# EAGLE design IrrigationControl (EAGLE 7.0.0)
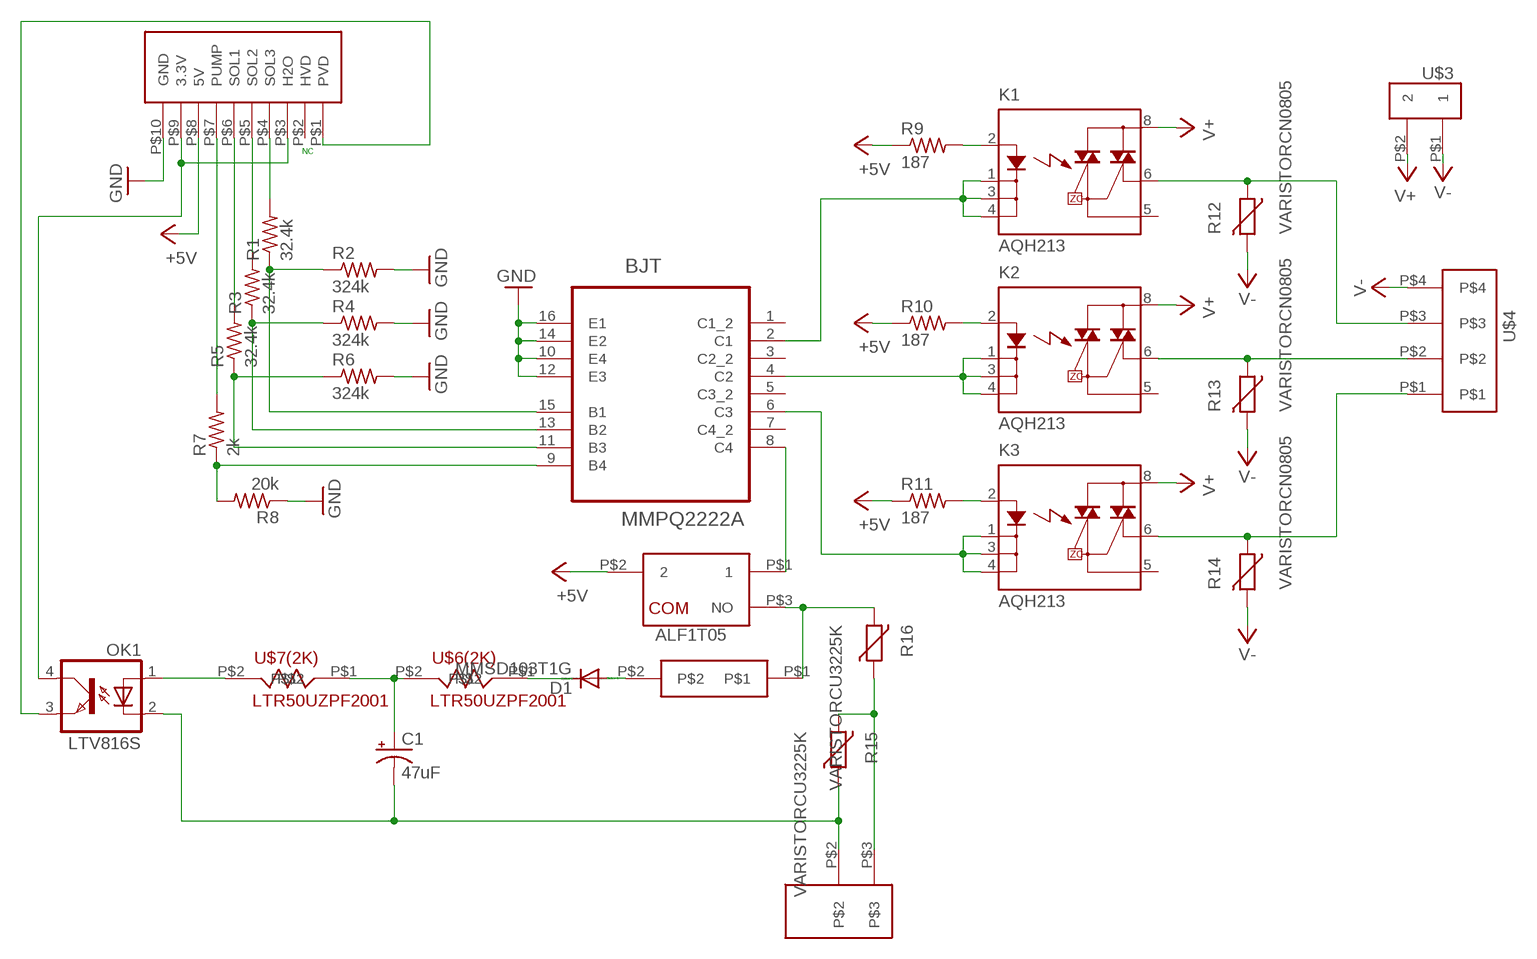
[diagram p0: schematic, sheet 1]

## Parts
ALF1T05  ALF1T05  [TMP]
BJT  MMPQ2222A  [SOIC127P600X175-16N]
C1  47uF  CPOL-USE5-10.5  [E5-10,5]
D1  MMSD103T1G  DIODE-SOD123  [SOD123]
K1  AQH213  [DIL07]
K2  AQH213  [DIL07]
K3  AQH213  [DIL07]
OK1  LTV816S  [SMD4]
R1  32.4k  R-US_R0805  [R0805]
R2  324k  R-US_R0805  [R0805]
R3  32.4k  R-US_R0805  [R0805]
R4  324k  R-US_R0805  [R0805]
R5  32.4k  R-US_R0805  [R0805]
R6  324k  R-US_R0805  [R0805]
R7  2k  R-US_R0805  [R0805]
R8  20k  R-US_R0805  [R0805]
R9  187  R-US_R0805  [R0805]
R10  187  R-US_R0805  [R0805]
R11  187  R-US_R0805  [R0805]
R12  VARISTORCN0805  [CT/CN0805]
R13  VARISTORCN0805  [CT/CN0805]
R14  VARISTORCN0805  [CT/CN0805]
R15  VARISTORCU3225K  [CU3225K]
R16  VARISTORCU3225K  [CU3225K]
U$1  OSTT7030150  [OSTT7030150]
U$2  OSTTE100104  [OSTTE100104]
U$3  OSTTC020162  [OSTTC020162]
U$4  OSTTE040104  [OSTTEX040104]
U$5  SST-357  [SST]
U$6(2K)  LTR50UZPF2001  [WIDE2010]
U$7(2K)  LTR50UZPF2001  [WIDE2010]

## Nets
+5V: ALF1T05.P$2 R9.1 R10.1 R11.1 U$2.P$8(5V)
GND: BJT.10(E4) BJT.12(E3) BJT.14(E2) BJT.16(E1) R2.2 R4.2 R6.2 R8.1 U$2.P$10(GND)
N$1: BJT.13(B2) R3.1 R4.1
N$2: R7.2 U$2.P$7(PUMP)
N$3: BJT.15(B1) R1.1 R2.1
N$4: R5.2 U$2.P$6(SOL1)
N$5: R3.2 U$2.P$5(SOL2)
N$6: BJT.11(B3) R5.1 R6.1
N$7: BJT.9(B4) R7.1 R8.2
N$8: OK1.4(COL) U$2.P$3(H2O) U$2.P$9(3.3V)
N$9: ALF1T05.P$1 BJT.8(C4)
N$10 [120VAC]: ALF1T05.P$3(NO) R16.2 U$5.P$1
N$11: K3.2(A) R11.2
N$12: K2.2(A) R10.2
N$13: K1.2(A) R9.2
N$14: BJT.6(C3) K3.1(K) K3.3(K1) K3.4(K2)
N$15: BJT.4(C2) K2.1(K) K2.3(K1) K2.4(K2)
N$16: BJT.2(C1) K1.1(K) K1.3(K1) K1.4(K2)
N$18: K1.6(DS3) R12.1 U$4.P$3
N$19: K2.6(DS3) R13.1 U$4.P$2
N$20: K3.6(DS3) R14.1 U$4.P$1
N$21 [120VAC]: D1.A U$5.P$2
N$22 [120VAC]: R15.2 R16.1 U$1.P$3
N$23 [120VAC]: C1.- OK1.2(C) R15.1 U$1.P$2
N$24 [170VDC]: D1.C U$6(2K).P$1
N$25 [85VDC]: C1.+ U$6(2K).P$2 U$7(2K).P$1
N$26: OK1.1(A) U$7(2K).P$2
N$27: OK1.3(EMIT) U$2.P$1(PVD)
N$29: R1.2 U$2.P$4(SOL3)
V+: K1.8(DS1) K2.8(DS1) K3.8(DS1) U$3.P$2
V-: R12.2 R13.2 R14.2 U$3.P$1 U$4.P$4
Unconnected: BJT.1(C1_2) BJT.3(C2_2) BJT.5(C3_2) BJT.7(C4_2) K1.5(DS2) K2.5(DS2) K3.5(DS2) U$2.P$2(HVD)

## Notes on the sheet
- NC

## Library data of the parts
ALF1T05 = TJ:ALF1T05: 20 Amp Power Relay from Panasonic
BJT = Fairchild_By_element14_Batch_1:MMPQ2222A: NPN Multi-Chip General Purpose Amplifier; MPN: MMPQ2222A; OC_FARNELL: 2101390; OC_NEWARK: 10P1562; PACKAGE: SOIC-16; SUPPLIER: FAIRCHILD SEMICONDUCTOR
C1 = rcl:CPOL-US: POLARIZED CAPACITOR, American symbol
D1 = diode:DIODE-: DIODE
K1-K3 = relay:AQH*213: SOLID STATE RELAY NAiS Source: http://www.mew-europe.com/.. en_ds_61613_0000.pdf; OC_FARNELL: unknown; OC_NEWARK: unknown
OK1 = optocoupler:LTV816: OPTO COUPLER Source: LITEON, LTV816.pdf; OC_FARNELL: unknown; OC_NEWARK: unknown
R1-R11 = resistor:R-US_: RESISTOR, American symbol
R12-R16 = varistor:VARISTOR: VARISTOR
U$1 = TJ:OSTT7030150
U$2 = TJ:OSTTE100104
U$3 = TJ:OSTTC020162
U$4 = TJ:OSTTE040104
U$5 = TJ:SST-357: 375mA, 125VAC tolerant slow blow surface mount fuse from Bel Fuse Inc.
U$6(2K) U$7(2K) = TJ:LTR50UZPF2001

## Net classes
1 120VAC: width 1.778 mm, drill 2.159 mm, clearance 2.159 mm
2 170VDC: width 1.27 mm, drill 2.159 mm, clearance 2.159 mm
3 85VDC: drill 1.092 mm, clearance 1.092 mm

## Board
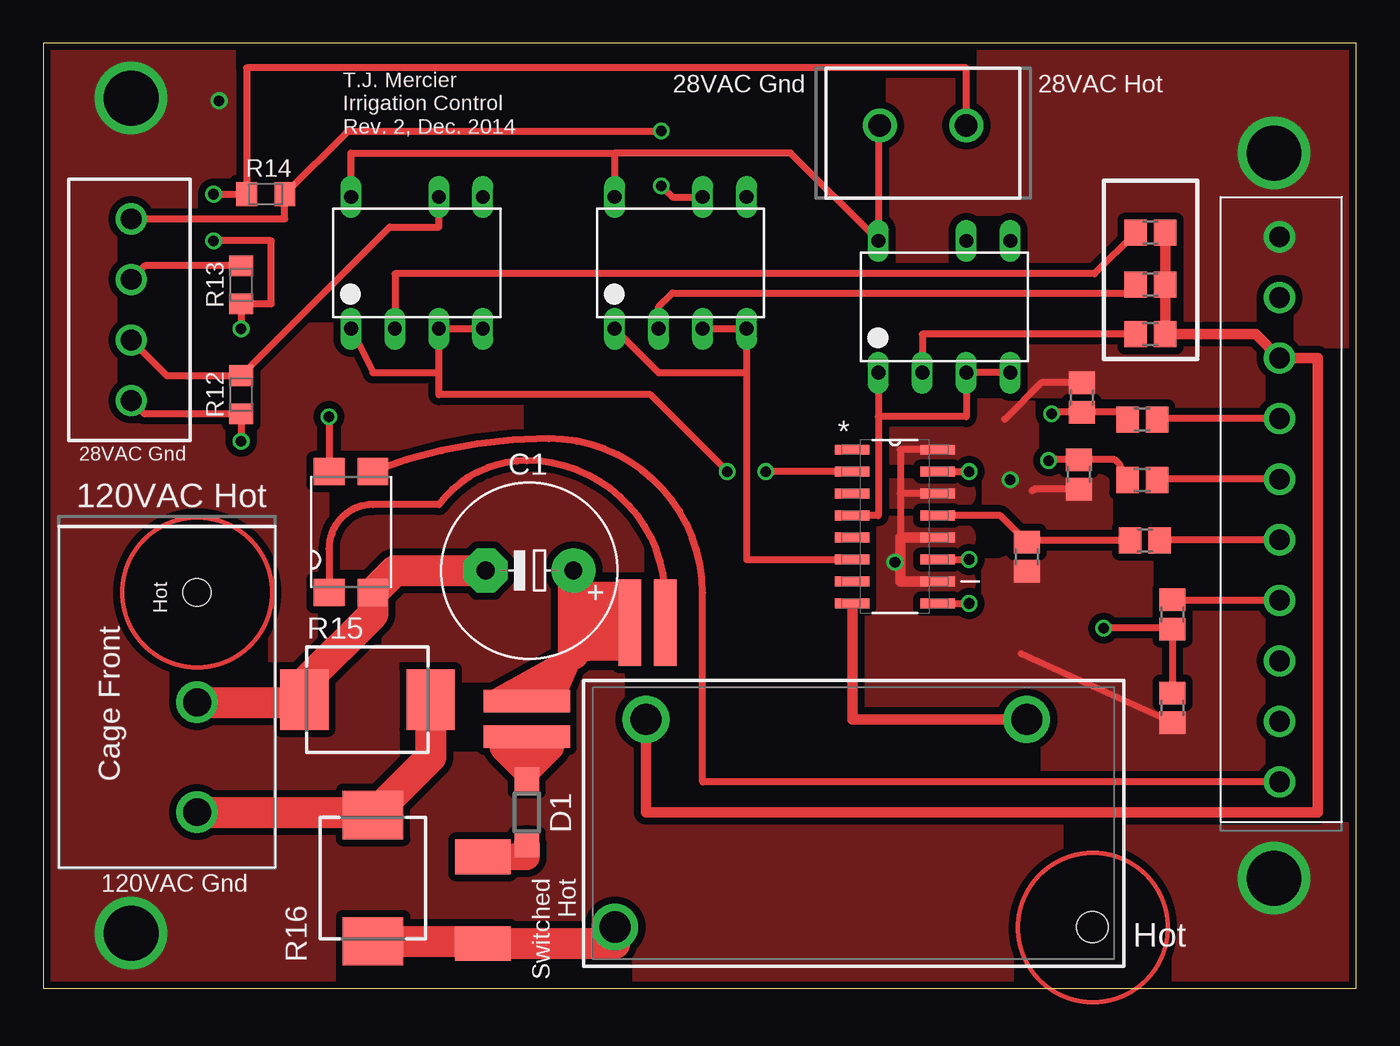
[diagram p1: board, top side]
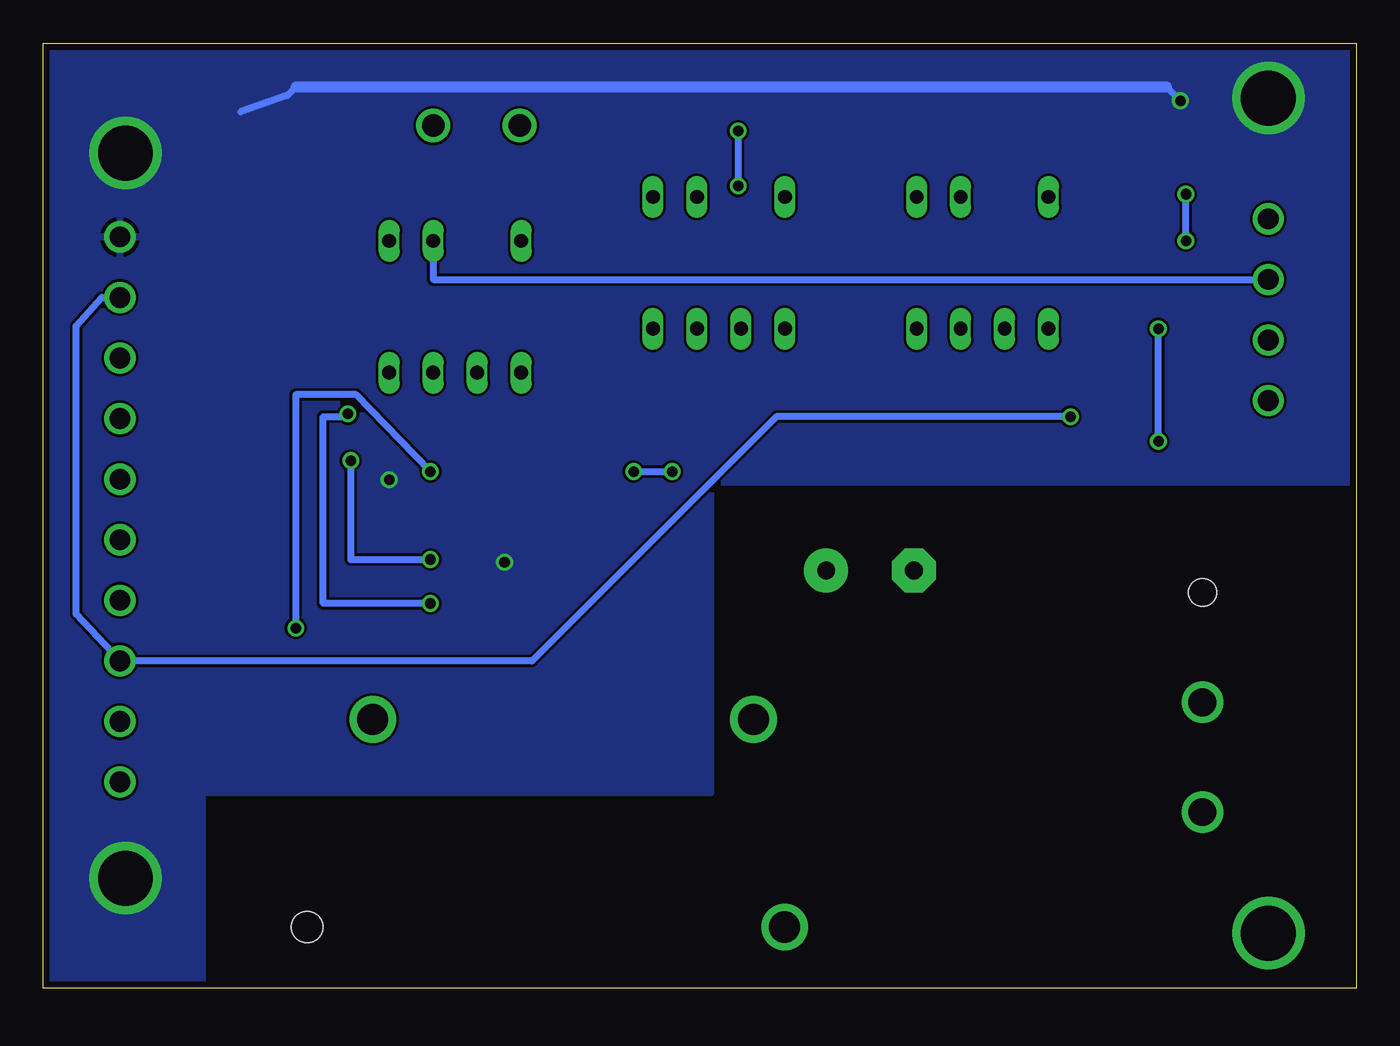
[diagram p2: board, bottom side, seen from below]

Size 75.87 x 54.6 mm. Coordinates in mm from the lower left corner, seen from the top.
Outline: 0,0 75.87,0 75.87,54.6 0,54.6 0,0
Copper layers (1*16): Top 0.0356mm / dielectric 1.5011mm / Bottom 0.0356mm
Design rules "LaenPCBOrder": minimum track width 6mil, minimum drill 13mil, track to track 6mil, track to pad 6mil, pad to pad 6mil, via to via 6mil, smd to smd 6mil, copper to edge 15mil, drill to drill 6mil, minimum pad ring 7mil, minimum via ring 7mil, stop-mask expansion 3mil, vias tented up to drill 0mil, thermal gap 10mil

### Footprints (pad centres in the part's own frame; a part is rotated, then mirrored left to right if it is on the bottom)
TMP = drill 1.8: P$1 -10,-6; P$2 12,-6; P$3 13.8,6 | hole 1.8: -13.8,6
SOIC127P600X175-16N = smd 1.981 x 0.559: 1 -2.464,4.445; 2 -2.464,3.175; 3 -2.464,1.905; 4 -2.464,0.635; 5 -2.464,-0.635; 6 -2.464,-1.905; 7 -2.464,-3.175; 8 -2.464,-4.445; 9 2.464,-4.445; 10 2.464,-3.175; 11 2.464,-1.905; 12 2.464,-0.635; 13 2.464,0.635; 14 2.464,1.905; 15 2.464,3.175; 16 2.464,4.445
E5-10,5 = drill 1.016 pad 2.54: + -2.54,0 | drill 1.016 pad 2.54 octagon: - 2.54,0
SOD123 = smd 1.4 x 1.4: A 1.9,0; C -1.9,0
DIL07 = drill 0.8 long: 1 -3.81,-3.81; 2 -1.27,-3.81; 3 1.27,-3.81; 4 3.81,-3.81; 5 3.81,3.81; 6 1.27,3.81; 8 -3.81,3.81
SMD4 = smd 1.78 x 1.55: 1 -1.27,-3.5; 2 1.27,-3.5; 3 1.27,3.5; 4 -1.27,3.5
R0805 = smd 1.3 x 1.5: 1 -0.85,0; 2 0.85,0
CT/CN0805 = smd 1.2 x 1.4: 1 -1.1,0; 2 1.1,0
CU3225K = smd 2.8 x 3.5: 1 -3.65,0; 2 3.65,0
OSTT7030150 = drill 1.6: P$2 6.35,0; P$3 12.7,0 | hole 1.6: 0,0
OSTTE100104 = drill 1.2: P$1 0,0; P$2 3.5,0; P$3 7,0; P$4 10.5,0; P$5 14,0; P$6 17.5,0; P$7 21,0; P$8 24.5,0; P$9 28,0; P$10 31.5,0
OSTTC020162 = drill 1.3: P$1 0,0; P$2 5,0
OSTTEX040104 = drill 1.2: P$1 0,0; P$2 3.5,0; P$3 7,0; P$4 10.5,0
SST = smd 2 x 3.18: P$1 -2.5,0; P$2 2.5,0
WIDE2010 = smd 1.3 x 5: P$1 -1.025,0; P$2 1.025,0

### Placement (x,y rotation side)
ALF1T05  46.83,9.53 180 top
BJT  49.21,26.67 0 top
C1  28.1,24.13 180 top
D1  27.94,10.16 270 top
K1  21.59,41.91 0 top
K2  52.07,39.37 0 top
K3  36.83,41.91 0 top
OK1  17.78,26.35 0 top
R1  65.25,21.59 90 top
R2  65.25,16.19 270 top
R3  63.66,25.88 0 top
R4  56.83,24.92 270 top
R5  63.5,29.37 0 top
R6  59.85,29.69 270 top
R7  63.5,32.86 0 top
R8  60.01,34.13 270 top
R9  63.98,43.66 180 top
R10  63.98,37.78 180 top
R11  63.98,40.64 180 top
R12  11.43,34.29 270 top
R13  11.43,40.64 270 top
R14  12.86,45.88 180 top
R15  18.73,16.67 0 top
R16  19.05,6.35 270 top
U$1  8.89,22.86 270 top
U$2  71.44,11.91 90 top
U$3  53.34,49.85 180 top
U$4  5.08,44.45 270 top
U$5  25.4,5.08 90 top
U$6(2K)  27.94,15.56 90 top
U$7(2K)  34.92,21.11 0 top

### Tracks (layer width: path | path; a pad name or v marks a point on that pad's centre or on a via)
+5V
  Top 0.61: ALF1T05.P$2 34.83,10.16 73.66,10.16 73.66,36.41 U$2.P$8 70.06,37.78 R10.1 R11.1 R9.1
GND  (via drill 0.61, 3.17)
  Top 0.406: R2.2 56.52,19.31 | BJT.14 49.53,28.57 | 49.53,28.57 49.53,26.04 | BJT.16 49.53,31.11 49.53,28.57 | R8.1 57.68,34.98 55.56,32.86 | R6.2 57.25,28.84 57.15,28.73
  Top 0.61: BJT.10 49.53,23.5 49.53,26.04 BJT.12
  Bottom 0.406: v10.16,51.28 10.95,52.07 | 61.28,52.07 61.75,51.59 64.45,50.64
  Bottom 0.635: 10.95,52.07 61.28,52.07
  other vias: 5.08,51.44 5.08,3.17 71.12,48.26 71.12,6.35 55.88,29.37 49.21,24.61
  pour Top (isolate 0.406): -1.27,54.61 35.56,54.61 35.56,55.88 77.47,55.88 77.47,-1.27 -1.27,-1.27
  pour Bottom: -0.64,29.21 37.31,29.21 37.31,11.27 66.67,11.27 66.67,-2.06 77.63,-2.06 77.63,-2.54 78.42,-2.54 78.42,56.04 -2.38,56.04 -2.38,55.72 -0.64,55.72
N$1
  Top 0.406: R3.1 56.94,25.88 R4.1 55.3,27.3 BJT.13
N$2
  Top 0.406: U$2.P$7 64.39,32.91 R7.2
N$3  (via drill 0.61)
  Top 0.406: BJT.15 v53.5,29.84 | R2.1 R1.1 65.19,20.8 v61.28,20.8
  Bottom 0.406: v53.5,29.84 57.78,34.29 61.28,34.29 v61.28,20.8
N$4
  Top 0.406: U$2.P$6 64.39,29.41 R5.2
N$5
  Top 0.406: U$2.P$5 64.54,25.91 R3.2
N$6  (via drill 0.61)
  Top 0.406: R5.1 62.23,30.22 61.91,30.54 R6.1 58.1,30.54 v58.1,30.48 | BJT.11 v53.5,24.77
  Bottom 0.406: v58.1,30.48 58.1,24.77 v53.5,24.77
N$7  (via drill 0.61)
  Top 0.406: BJT.9 v53.5,22.23 | v58.26,33.18 58.26,33.28 R8.2 62.23,33.28 R7.1
  Bottom 0.406: v53.5,22.23 59.69,22.23 59.69,33.02 58.26,33.02 v58.26,33.18
N$8  (via drill 0.61)
  Top 0.406: v16.51,33.02 OK1.4
  Bottom 0.406: U$2.P$9 72.49,39.91 73.98,38.26 73.98,21.61 U$2.P$3 71.42,18.89 47.62,18.89 33.5,33.02 v16.51,33.02
N$9
  Top 0.61: ALF1T05.P$1 46.75,15.53 BJT.8
N$10
  Top 1.778: R16.2 25.4,2.7 U$5.P$1 33.03,2.58 ALF1T05.P$3
N$11
  Top 0.406: K3.2 35.56,39.37 36.35,40.16 63.13,40.16 R11.2
N$12
  Top 0.406: R10.2 50.8,37.78 K2.2
N$13
  Top 0.406: R9.2 60.74,41.27 20.32,41.27 K1.2
N$14
  Top 0.406: 40.64,35.56 K3.4 K3.3 | 40.64,35.56 40.64,24.77 BJT.6 | K3.1 35.56,35.56 40.64,35.56
N$15
  Top 0.406: K2.1 48.26,33.02 | 48.26,33.02 48.26,27.3 BJT.4 | K2.4 K2.3 53.34,33.02 48.26,33.02
N$16  (via drill 0.61)
  Top 0.406: BJT.2 v41.75,29.84 | v39.53,29.84 35.08,34.29 22.86,34.29 22.86,35.56 | 22.86,35.56 K1.3 K1.4 | K1.1 19.05,35.56 22.86,35.56
  Bottom 0.406: v41.75,29.84 v39.53,29.84
N$18
  Top 0.406: U$4.P$3 7.14,35.39 R12.1 20.01,43.97 22.86,43.97 K1.6
N$19
  Top 0.406: R13.1 5.87,41.74 U$4.P$2
  Bottom 0.406: K2.6 53.34,40.95 U$4.P$2
N$20  (via drill 0.61)
  Top 0.406: U$4.P$1 13.96,44.45 R14.1 17.61,49.53 v35.72,49.53 | v35.72,46.35 36.35,45.72 K3.6
  Bottom 0.406: v35.72,49.53 v35.72,46.35
N$21
  Top 1.524: U$5.P$2 27.94,7.58 D1.A
N$22
  Top 1.778: U$1.P$3 19.05,10.16 R16.1 22.38,13.33 R15.2
N$23
  Top 1.778: U$1.P$2 14.92,16.51 R15.1 15.08,17.62 19.05,21.59 OK1.2 20.33,24.13 C1.-
N$24
  Top 1.27: U$6(2K).P$1 27.94,12.7 D1.C
  Top 1.778: 27.94,13.97 26.67,13.97 27.94,12.7 | 27.94,13.97 29.21,13.97 27.94,12.7 | 27.94,13.97 27.94,12.7
N$25
  Top 1.27: U$6(2K).P$2 30.64,19.28 | U$7(2K).P$1 31.11,21.11 30.64,21.59
  Top 1.778: 30.64,19.28 30.64,21.59 C1.+
N$26
  Top 0.406: U$7(2K).P$2 35.95,22.47 arc90 27.94,30.48 arc53 22.86,27.94 19.05,27.94 arc90 16.51,25.4 OK1.1
N$27
  Top 0.406: U$2.P$1 38.1,11.91 38.1,22.86 arc90 29.21,31.75 arc21 OK1.3
N$29
  Top 0.406: U$2.P$4 65.28,22.41 R1.2
N$31
  Top 1.27: 26.19,16.67 30.48,19.05 29.53,16.83
N$32
  Top 1.27: 33.02,21.59 31.75,21.59
N$33
  Top 1.27: 33.5,22.38 31.27,22.38
N$34
  Top 1.27: 33.5,20.16 31.75,20.16
N$35
  Top 1.27: 33.66,19.53 31.43,19.53
N$36
  Top 1.27: 31.43,22.86 33.18,22.86
V+
  Top 0.406: U$3.P$2 48.26,49.77 K2.8 43.18,48.26 33.02,48.26 | 33.02,48.26 K3.8 | K1.8 17.78,48.26 33.02,48.26
V-  (via drill 0.61)
  Top 0.406: U$3.P$1 53.34,53.18 11.75,53.18 11.75,45.88 R14.2 v9.84,45.88 | U$4.P$4 5.84,33.19 R12.2 v11.43,31.59 | v11.43,38.1 R13.2 13.18,39.54 13.18,43.18 v9.84,43.18
  Bottom 0.406: v11.43,31.59 v11.43,38.1 | v9.84,43.18 v9.84,45.88
(copper drawn outside any net)
  shapes: Top circle x2

### Text on the board
tPlace: 28VAC Gnd | 28VAC Hot | T.J. Mercier / Irrigation Control / Rev. 2, Dec. 2014 | 28VAC Gnd | 120VAC Hot | 120VAC Gnd | Switched / Hot | Hot